# Altium project S7_CAS_lepo3002.PrjPcb (part 4 of 4)
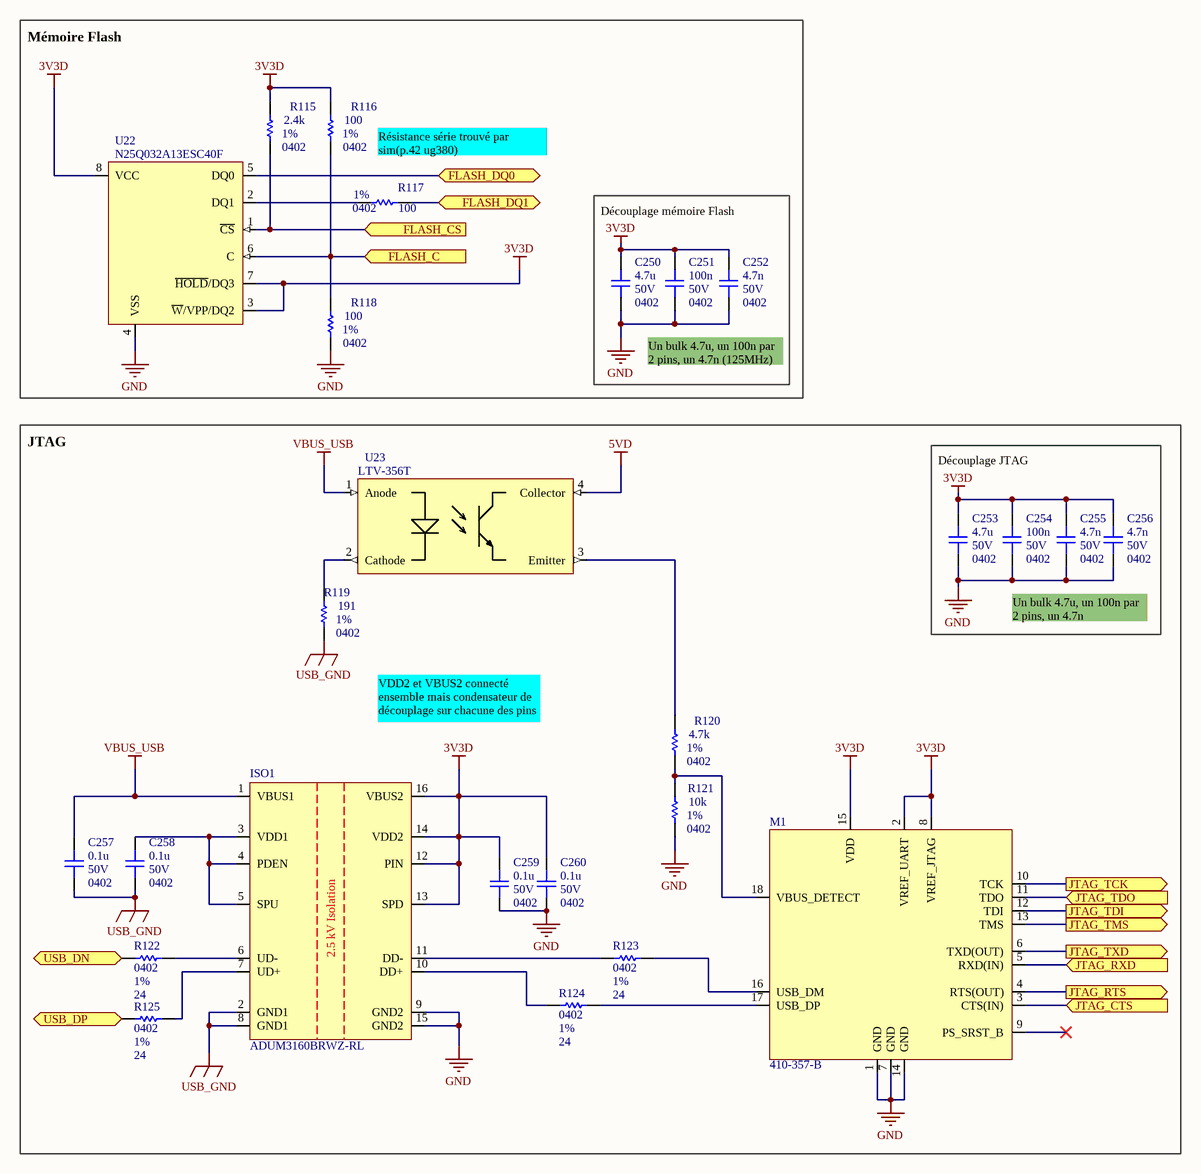
[diagram p15: PROB_S7CAS_FLASH-JTAG.SchDoc]

## Nets that join several sheets
1V2D: PROB_S7CAS_ArbreAlimentation (C30.1 C31.2 U6.4 U6.5), PROB_S7CAS_FPGA_2 (31 pins), PROB_S7CAS_PHY (C172.2 C173.2 U16.2)
1V5D: PROB_S7CAS_ArbreAlimentation (C27.2 R10.2 U1.9 U1.10), PROB_S7CAS_FPGA_2 (15 pins), PROB_S7CAS_FPGA_3 (20 pins), PROB_S7CAS_DDR (28 pins)
1V8D: PROB_S7CAS_ArbreAlimentation (8 pins), PROB_S7CAS_FPGA_1 (14 pins), PROB_S7CAS_DAC (15 pins), PROB_S7CAS_ADC (11 pins)
3V3A: PROB_S7CAS_ArbreAlimentation (C42.1 C43.2 U8.4 U8.5), PROB_S7CAS_INTERFACE (5 pins), PROB_S7CAS_PHY (L5.1), PROB_S7CAS_DAC (11 pins), PROB_S7CAS_ADC (9 pins)
3V3D: PROB_S7CAS_ArbreAlimentation (C20.1 C21.2 U4.4 U4.5), PROB_S7CAS_FPGA_1 (17 pins), PROB_S7CAS_FPGA_2 (47 pins), PROB_S7CAS_INTERFACE (U11.3 U12.3), PROB_S7CAS_Clock (26 pins), PROB_S7CAS_PHY (C174.2 C175.2 U16.17), PROB_S7CAS_MOTDRIVER (C240.2 R107.2 R110.2 U21.10), PROB_S7CAS_FLASH-JTAG (21 pins)
3V3DDR: PROB_S7CAS_ArbreAlimentation (C16.1 C17.2 U3.4 U3.5), PROB_S7CAS_DDR (C159.2 R57.2 U15.7 U15.10)
5VD: PROB_S7CAS_ArbreAlimentation (21 pins), PROB_S7CAS_FLASH-JTAG (U23.4)
5VN: PROB_S7CAS_ArbreAlimentation (C33.2 U9.5), PROB_S7CAS_DAC (C196.1 C197.1 C198.1 U18.4), PROB_S7CAS_ADC (12 pins)
5VP: PROB_S7CAS_ArbreAlimentation (12 pins), PROB_S7CAS_DAC (C186.2 C187.2 C188.2 U18.8), PROB_S7CAS_ADC (15 pins)
24V: PROB_S7CAS_Connectors (D2.2 D4.1 Q1.2), PROB_S7CAS_ArbreAlimentation (8 pins), PROB_S7CAS_INTERFACE (D18.A), PROB_S7CAS_MOTDRIVER (6 pins)
DDR_VREF: PROB_S7CAS_FPGA_2 (U10.AD7 U10.L6 U10.R6 U10.V6), PROB_S7CAS_DDR (6 pins)
GND: PROB_S7CAS_Title (MTH3.1 MTH4.1 MTH5.1), PROB_S7CAS_Connectors (35 pins), PROB_S7CAS_ArbreAlimentation (65 pins), PROB_S7CAS_FPGA_1 (10 pins), PROB_S7CAS_FPGA_2 (100 pins), PROB_S7CAS_FPGA_3 (8 pins), PROB_S7CAS_INTERFACE (11 pins), PROB_S7CAS_Clock (38 pins), PROB_S7CAS_DDR (72 pins), PROB_S7CAS_PHY (20 pins), PROB_S7CAS_DAC (35 pins), PROB_S7CAS_ADC (47 pins), PROB_S7CAS_MOTDRIVER (17 pins), PROB_S7CAS_FLASH-JTAG (17 pins)
USB_GND: PROB_S7CAS_Connectors (D5.4 J3.4 J3.5 J3.6), PROB_S7CAS_FLASH-JTAG (5 pins)
VBUS_USB: PROB_S7CAS_Connectors (L1.1), PROB_S7CAS_FLASH-JTAG (C257.2 ISO1.1 U23.1)
590BD_OE: PROB_S7CAS_FPGA_1 (U10.AA23), PROB_S7CAS_Clock (Y1.2)
AD91_CS: PROB_S7CAS_FPGA_1 (U10.V18), PROB_S7CAS_DAC (U17.33)
AD91_D0N: PROB_S7CAS_FPGA_2 (U10.Y13), PROB_S7CAS_DAC (U17.28)
AD91_D0P: PROB_S7CAS_FPGA_2 (U10.W13), PROB_S7CAS_DAC (U17.27)
AD91_D1N: PROB_S7CAS_FPGA_2 (U10.AB13), PROB_S7CAS_DAC (U17.26)
AD91_D1P: PROB_S7CAS_FPGA_2 (U10.AA13), PROB_S7CAS_DAC (U17.25)
AD91_D2N: PROB_S7CAS_FPGA_2 (U10.V14), PROB_S7CAS_DAC (U17.24)
AD91_D2P: PROB_S7CAS_FPGA_2 (U10.U15), PROB_S7CAS_DAC (U17.23)
AD91_D3N: PROB_S7CAS_FPGA_2 (U10.AB11), PROB_S7CAS_DAC (U17.22)
AD91_D3P: PROB_S7CAS_FPGA_2 (U10.AA11), PROB_S7CAS_DAC (U17.21)
AD91_D4N: PROB_S7CAS_FPGA_2 (U10.W14), PROB_S7CAS_DAC (U17.16)
AD91_D4P: PROB_S7CAS_FPGA_2 (U10.V13), PROB_S7CAS_DAC (U17.15)
AD91_D5N: PROB_S7CAS_FPGA_2 (U10.AD11), PROB_S7CAS_DAC (U17.14)
AD91_D5P: PROB_S7CAS_FPGA_2 (U10.AC11), PROB_S7CAS_DAC (U17.13)
AD91_D6N: PROB_S7CAS_FPGA_2 (U10.W12), PROB_S7CAS_DAC (U17.12)
AD91_D6P: PROB_S7CAS_FPGA_2 (U10.V12), PROB_S7CAS_DAC (U17.11)
AD91_D7N: PROB_S7CAS_FPGA_2 (U10.AF11), PROB_S7CAS_DAC (U17.10)
AD91_D7P: PROB_S7CAS_FPGA_2 (U10.AE11), PROB_S7CAS_DAC (U17.9)
AD91_DCIN: PROB_S7CAS_FPGA_2 (U10.U12), PROB_S7CAS_DAC (U17.18)
AD91_DCIP: PROB_S7CAS_FPGA_2 (U10.U13), PROB_S7CAS_DAC (U17.17)
AD91_FRAMEN: PROB_S7CAS_FPGA_2 (U10.AB10), PROB_S7CAS_DAC (U17.20)
AD91_FRAMEP: PROB_S7CAS_FPGA_2 (U10.Y10), PROB_S7CAS_DAC (U17.19)
AD91_IRQ: PROB_S7CAS_FPGA_1 (U10.V19), PROB_S7CAS_DAC (U17.34)
AD91_RESET: PROB_S7CAS_FPGA_1 (U10.U20), PROB_S7CAS_DAC (U17.36)
AD91_SCLK: PROB_S7CAS_FPGA_1 (U10.AC23), PROB_S7CAS_DAC (U17.32)
AD91_SDIO: PROB_S7CAS_FPGA_1 (U10.AC24), PROB_S7CAS_DAC (U17.31)
AD91_TXENABLE: PROB_S7CAS_FPGA_1 (U10.AE24), PROB_S7CAS_DAC (U17.30)
ADC_1: PROB_S7CAS_Connectors (D6.1 J4.1), PROB_S7CAS_ADC (R94.2 R96.2)
ADC_2: PROB_S7CAS_Connectors (D8.1 J6.1), PROB_S7CAS_ADC (R101.2 R104.2)
ADS62_CLKOUTM: PROB_S7CAS_FPGA_1 (U10.C14), PROB_S7CAS_ADC (U19.56)
ADS62_CLKOUTP: PROB_S7CAS_FPGA_1 (U10.D14), PROB_S7CAS_ADC (U19.57)
ADS62_CTRL1: PROB_S7CAS_FPGA_1 (U10.R19), PROB_S7CAS_ADC (U19.35)
ADS62_CTRL2: PROB_S7CAS_FPGA_1 (U10.R17), PROB_S7CAS_ADC (U19.36)
ADS62_CTRL3: PROB_S7CAS_FPGA_1 (U10.R18), PROB_S7CAS_ADC (U19.37)
ADS62_DA0N: PROB_S7CAS_FPGA_1 (U10.G14), PROB_S7CAS_ADC (U19.40)
ADS62_DA0P: PROB_S7CAS_FPGA_1 (U10.J14), PROB_S7CAS_ADC (U19.41)
ADS62_DA2N: PROB_S7CAS_FPGA_1 (U10.D15), PROB_S7CAS_ADC (U19.42)
ADS62_DA2P: PROB_S7CAS_FPGA_1 (U10.E14), PROB_S7CAS_ADC (U19.43)
ADS62_DA4N: PROB_S7CAS_FPGA_1 (U10.C16), PROB_S7CAS_ADC (U19.44)
ADS62_DA4P: PROB_S7CAS_FPGA_1 (U10.D16), PROB_S7CAS_ADC (U19.45)
ADS62_DA6N: PROB_S7CAS_FPGA_1 (U10.F15), PROB_S7CAS_ADC (U19.46)
ADS62_DA6P: PROB_S7CAS_FPGA_1 (U10.G16), PROB_S7CAS_ADC (U19.47)
ADS62_DA8N: PROB_S7CAS_FPGA_1 (U10.E17), PROB_S7CAS_ADC (U19.50)
ADS62_DA8P: PROB_S7CAS_FPGA_1 (U10.F17), PROB_S7CAS_ADC (U19.51)
ADS62_DA10N: PROB_S7CAS_FPGA_1 (U10.E16), PROB_S7CAS_ADC (U19.52)
ADS62_DA10P: PROB_S7CAS_FPGA_1 (U10.F16), PROB_S7CAS_ADC (U19.53)
ADS62_DA12N: PROB_S7CAS_FPGA_1 (U10.A17), PROB_S7CAS_ADC (U19.54)
ADS62_DA12P: PROB_S7CAS_FPGA_1 (U10.C17), PROB_S7CAS_ADC (U19.55)
ADS62_DB0N: PROB_S7CAS_FPGA_1 (U10.H15), PROB_S7CAS_ADC (U19.60)
ADS62_DB0P: PROB_S7CAS_FPGA_1 (U10.J15), PROB_S7CAS_ADC (U19.61)
ADS62_DB2N: PROB_S7CAS_FPGA_1 (U10.C18), PROB_S7CAS_ADC (U19.62)
ADS62_DB2P: PROB_S7CAS_FPGA_1 (U10.D18), PROB_S7CAS_ADC (U19.63)
ADS62_DB4N: PROB_S7CAS_FPGA_1 (U10.D19), PROB_S7CAS_ADC (U19.2)
ADS62_DB4P: PROB_S7CAS_FPGA_1 (U10.E19), PROB_S7CAS_ADC (U19.3)
ADS62_DB6N: PROB_S7CAS_FPGA_1 (U10.G17), PROB_S7CAS_ADC (U19.4)
ADS62_DB6P: PROB_S7CAS_FPGA_1 (U10.H16), PROB_S7CAS_ADC (U19.5)
ADS62_DB8N: PROB_S7CAS_FPGA_1 (U10.C20), PROB_S7CAS_ADC (U19.6)
ADS62_DB8P: PROB_S7CAS_FPGA_1 (U10.D21), PROB_S7CAS_ADC (U19.7)
ADS62_DB10N: PROB_S7CAS_FPGA_1 (U10.E18), PROB_S7CAS_ADC (U19.8)
ADS62_DB10P: PROB_S7CAS_FPGA_1 (U10.F18), PROB_S7CAS_ADC (U19.9)
ADS62_DB12N: PROB_S7CAS_FPGA_1 (U10.D20), PROB_S7CAS_ADC (U19.10)
ADS62_DB12P: PROB_S7CAS_FPGA_1 (U10.E20), PROB_S7CAS_ADC (U19.11)
ADS62_RESET: PROB_S7CAS_FPGA_1 (U10.R21), PROB_S7CAS_ADC (U19.12)
ADS62_SCLK: PROB_S7CAS_FPGA_1 (U10.P17), PROB_S7CAS_ADC (U19.13)
ADS62_SDATA: PROB_S7CAS_FPGA_1 (U10.R20), PROB_S7CAS_ADC (U19.14)
ADS62_SDOUT: PROB_S7CAS_FPGA_1 (U10.R22), PROB_S7CAS_ADC (U19.64)
ADS62_SEN: PROB_S7CAS_FPGA_1 (U10.P18), PROB_S7CAS_ADC (U19.15)
CDCE_CLKN_100MHz: PROB_S7CAS_FPGA_1 (U10.A15), PROB_S7CAS_Clock (U13.17)
CDCE_CLKN_200MHz: PROB_S7CAS_Clock (U13.20), PROB_S7CAS_ADC (C206.1 R93.1)
CDCE_CLKN_400MHz: PROB_S7CAS_Clock (U13.28), PROB_S7CAS_DAC (C180.1 R85.1)
CDCE_CLKP_100MHz: PROB_S7CAS_FPGA_1 (U10.C15), PROB_S7CAS_Clock (U13.16)
CDCE_CLKP_200MHz: PROB_S7CAS_Clock (U13.19), PROB_S7CAS_ADC (C205.1 R93.2)
CDCE_CLKP_400MHz: PROB_S7CAS_Clock (U13.27), PROB_S7CAS_DAC (C179.1 R85.2)
CDCE_PLL_LOCK: PROB_S7CAS_FPGA_1 (U10.V17), PROB_S7CAS_Clock (U13.37)
CDCE_PWRDN: PROB_S7CAS_FPGA_1 (U10.T22), PROB_S7CAS_Clock (U13.12)
CDCE_REF_SEL: PROB_S7CAS_FPGA_1 (U10.U22), PROB_S7CAS_Clock (U13.31)
CDCE_SPI_CLK: PROB_S7CAS_FPGA_1 (U10.T18), PROB_S7CAS_Clock (U13.24)
CDCE_SPI_LE: PROB_S7CAS_FPGA_1 (U10.U23), PROB_S7CAS_Clock (U13.25)
CDCE_SPI_MISO: PROB_S7CAS_FPGA_1 (U10.U21), PROB_S7CAS_Clock (U13.22)
CDCE_SPI_MOSI: PROB_S7CAS_FPGA_1 (U10.T19), PROB_S7CAS_Clock (U13.23)
CDCE_SYNC: PROB_S7CAS_FPGA_1 (U10.U17), PROB_S7CAS_Clock (U13.14)
DAC_1: PROB_S7CAS_Connectors (D11.1 J7.1), PROB_S7CAS_DAC (R78.2)
DAC_2: PROB_S7CAS_Connectors (D13.1 J8.1), PROB_S7CAS_DAC (R87.2)
DDR3_A0: PROB_S7CAS_FPGA_2 (U10.N7), PROB_S7CAS_DDR (R34.1 U14.N3)
DDR3_A1: PROB_S7CAS_FPGA_2 (U10.N6), PROB_S7CAS_DDR (R35.1 U14.P7)
DDR3_A2: PROB_S7CAS_FPGA_2 (U10.R9), PROB_S7CAS_DDR (R36.1 U14.P3)
DDR3_A3: PROB_S7CAS_FPGA_2 (U10.P7), PROB_S7CAS_DDR (R37.1 U14.N2)
DDR3_A4: PROB_S7CAS_FPGA_2 (U10.N9), PROB_S7CAS_DDR (R38.1 U14.P8)
DDR3_A5: PROB_S7CAS_FPGA_2 (U10.R2), PROB_S7CAS_DDR (R39.1 U14.P2)
DDR3_A6: PROB_S7CAS_FPGA_2 (U10.R1), PROB_S7CAS_DDR (R40.1 U14.R8)
DDR3_A7: PROB_S7CAS_FPGA_2 (U10.P10), PROB_S7CAS_DDR (R41.1 U14.R2)
DDR3_A8: PROB_S7CAS_FPGA_2 (U10.N4), PROB_S7CAS_DDR (R42.1 U14.T8)
DDR3_A9: PROB_S7CAS_FPGA_2 (U10.N3), PROB_S7CAS_DDR (R43.1 U14.R3)
DDR3_A10: PROB_S7CAS_FPGA_2 (U10.M10), PROB_S7CAS_DDR (R44.1 U14.L7)
DDR3_A11: PROB_S7CAS_FPGA_2 (U10.L3), PROB_S7CAS_DDR (R45.1 U14.R7)
DDR3_A12: PROB_S7CAS_FPGA_2 (U10.M8), PROB_S7CAS_DDR (R46.1 U14.N7)
DDR3_A13: PROB_S7CAS_FPGA_2 (U10.M6), PROB_S7CAS_DDR (R47.1 U14.T3)
DDR3_BA0: PROB_S7CAS_FPGA_2 (U10.P3), PROB_S7CAS_DDR (R49.1 U14.M2)
DDR3_BA1: PROB_S7CAS_FPGA_2 (U10.P1), PROB_S7CAS_DDR (R50.1 U14.N8)
DDR3_BA2: PROB_S7CAS_FPGA_2 (U10.N5), PROB_S7CAS_DDR (R51.1 U14.M3)
DDR3_CAS: PROB_S7CAS_FPGA_2 (U10.P8), PROB_S7CAS_DDR (R55.1 U14.K3)
DDR3_CKE: PROB_S7CAS_FPGA_2 (U10.M9), PROB_S7CAS_DDR (R52.1 U14.K9)
DDR3_CKN: PROB_S7CAS_FPGA_2 (U10.R3), PROB_S7CAS_DDR (U14.K7)
DDR3_CKP: PROB_S7CAS_FPGA_2 (U10.R4), PROB_S7CAS_DDR (U14.J7)
DDR3_CS: PROB_S7CAS_FPGA_2 (U10.L7), PROB_S7CAS_DDR (R53.1 U14.L2)
DDR3_DQ0: PROB_S7CAS_FPGA_2 (U10.Y3), PROB_S7CAS_DDR (U14.E3)
DDR3_DQ1: PROB_S7CAS_FPGA_2 (U10.Y1), PROB_S7CAS_DDR (U14.F7)
DDR3_DQ2: PROB_S7CAS_FPGA_2 (U10.W2), PROB_S7CAS_DDR (U14.F2)
DDR3_DQ3: PROB_S7CAS_FPGA_2 (U10.W1), PROB_S7CAS_DDR (U14.F8)
DDR3_DQ4: PROB_S7CAS_FPGA_2 (U10.T3), PROB_S7CAS_DDR (U14.H3)
DDR3_DQ5: PROB_S7CAS_FPGA_2 (U10.T1), PROB_S7CAS_DDR (U14.H8)
DDR3_DQ6: PROB_S7CAS_FPGA_2 (U10.U2), PROB_S7CAS_DDR (U14.G2)
DDR3_DQ7: PROB_S7CAS_FPGA_2 (U10.U1), PROB_S7CAS_DDR (U14.H7)
DDR3_DQ8: PROB_S7CAS_FPGA_2 (U10.AA2), PROB_S7CAS_DDR (U14.D7)
DDR3_DQ9: PROB_S7CAS_FPGA_2 (U10.AA1), PROB_S7CAS_DDR (U14.C3)
DDR3_DQ10: PROB_S7CAS_FPGA_2 (U10.AE2), PROB_S7CAS_DDR (U14.C8)
DDR3_DQ11: PROB_S7CAS_FPGA_2 (U10.AE1), PROB_S7CAS_DDR (U14.C2)
DDR3_DQ12: PROB_S7CAS_FPGA_2 (U10.AD3), PROB_S7CAS_DDR (U14.A7)
DDR3_DQ13: PROB_S7CAS_FPGA_2 (U10.AD1), PROB_S7CAS_DDR (U14.A2)
DDR3_DQ14: PROB_S7CAS_FPGA_2 (U10.AB3), PROB_S7CAS_DDR (U14.B8)
DDR3_DQ15: PROB_S7CAS_FPGA_2 (U10.AB1), PROB_S7CAS_DDR (U14.A3)
DDR3_LDM: PROB_S7CAS_FPGA_2 (U10.W3), PROB_S7CAS_DDR (U14.E7)
DDR3_LDQS_N: PROB_S7CAS_FPGA_2 (U10.V1), PROB_S7CAS_DDR (U14.G3)
DDR3_LDQS_P: PROB_S7CAS_FPGA_2 (U10.V3), PROB_S7CAS_DDR (U14.F3)
DDR3_ODT: PROB_S7CAS_FPGA_2 (U10.P6), PROB_S7CAS_DDR (R48.1 U14.K1)
DDR3_RAS: PROB_S7CAS_FPGA_2 (U10.N8), PROB_S7CAS_DDR (R54.1 U14.J3)
DDR3_RESET: PROB_S7CAS_FPGA_2 (U10.L4), PROB_S7CAS_DDR (U14.T2)
DDR3_UDM: PROB_S7CAS_FPGA_2 (U10.V4), PROB_S7CAS_DDR (U14.D3)
DDR3_UDQS_N: PROB_S7CAS_FPGA_2 (U10.AC1), PROB_S7CAS_DDR (U14.B7)
DDR3_UDQS_P: PROB_S7CAS_FPGA_2 (U10.AC2), PROB_S7CAS_DDR (U14.C7)
DDR3_WE: PROB_S7CAS_FPGA_2 (U10.P5), PROB_S7CAS_DDR (R56.1 U14.L3)
DN: PROB_S7CAS_Connectors (D5.3 J3.2), PROB_S7CAS_FLASH-JTAG (R122.2)
DP: PROB_S7CAS_Connectors (D5.5 J3.3), PROB_S7CAS_FLASH-JTAG (R125.2)
DRV8811_AOUT1: PROB_S7CAS_Connectors (D7.1 J5.1), PROB_S7CAS_MOTDRIVER (U21.4)
DRV8811_AOUT2: PROB_S7CAS_Connectors (D12.1 J5.4), PROB_S7CAS_MOTDRIVER (U21.25)
DRV8811_BOUT1: PROB_S7CAS_Connectors (D9.1 J5.2), PROB_S7CAS_MOTDRIVER (U21.11)
DRV8811_BOUT2: PROB_S7CAS_Connectors (D10.1 J5.3), PROB_S7CAS_MOTDRIVER (U21.18)
DRV8811_DIR: PROB_S7CAS_FPGA_1 (U10.E8), PROB_S7CAS_MOTDRIVER (U21.3)
DRV8811_EN: PROB_S7CAS_FPGA_1 (U10.A7), PROB_S7CAS_MOTDRIVER (U21.26)
DRV8811_HOME: PROB_S7CAS_FPGA_1 (U10.F9), PROB_S7CAS_MOTDRIVER (U21.2)
DRV8811_RESET: PROB_S7CAS_FPGA_1 (U10.C7), PROB_S7CAS_MOTDRIVER (U21.17)
DRV8811_SLEEP: PROB_S7CAS_FPGA_1 (U10.D6), PROB_S7CAS_MOTDRIVER (U21.27)
DRV8811_SR: PROB_S7CAS_FPGA_1 (U10.C8), PROB_S7CAS_MOTDRIVER (U21.16)
DRV8811_STEP: PROB_S7CAS_FPGA_1 (U10.A5), PROB_S7CAS_MOTDRIVER (U21.19)
DRV8811_USM0: PROB_S7CAS_FPGA_1 (U10.D7), PROB_S7CAS_MOTDRIVER (U21.13)
DRV8811_USM1: PROB_S7CAS_FPGA_1 (U10.D8), PROB_S7CAS_MOTDRIVER (U21.12)
FLASH_C: PROB_S7CAS_FPGA_2 (U10.AD22), PROB_S7CAS_FLASH-JTAG (R116.1 R118.2 U22.6)
FLASH_CS: PROB_S7CAS_FPGA_2 (U10.AF4), PROB_S7CAS_FLASH-JTAG (R115.1 U22.1)
FLASH_DQ0: PROB_S7CAS_FPGA_2 (U10.AF20), PROB_S7CAS_FLASH-JTAG (U22.5)
FLASH_DQ1: PROB_S7CAS_FPGA_2 (U10.AD20), PROB_S7CAS_FLASH-JTAG (R117.2)
FPGA_BTN0: PROB_S7CAS_FPGA_1 (U10.T20), PROB_S7CAS_INTERFACE (R29.2 SW2.2 SW2.3)
FPGA_BTN1: PROB_S7CAS_FPGA_1 (U10.AA24), PROB_S7CAS_INTERFACE (R30.2 SW3.2 SW3.3)
FPGA_LED0: PROB_S7CAS_FPGA_1 (U10.A4), PROB_S7CAS_INTERFACE (D14.A)
FPGA_LED1: PROB_S7CAS_FPGA_1 (U10.E6), PROB_S7CAS_INTERFACE (D15.A)
FPGA_LED2: PROB_S7CAS_FPGA_1 (U10.D5), PROB_S7CAS_INTERFACE (D16.A)
FPGA_LED3: PROB_S7CAS_FPGA_1 (U10.C5), PROB_S7CAS_INTERFACE (D17.A)
FPGA_RESET: PROB_S7CAS_FPGA_2 (U10.AF3), PROB_S7CAS_INTERFACE (R23.1 SW1.1 SW1.4)
JTAG_CTS: PROB_S7CAS_FPGA_1 (U10.A6), PROB_S7CAS_FLASH-JTAG (M1.3)
JTAG_RTS: PROB_S7CAS_FPGA_1 (U10.B6), PROB_S7CAS_FLASH-JTAG (M1.4)
JTAG_RXD: PROB_S7CAS_FPGA_1 (U10.F7), PROB_S7CAS_FLASH-JTAG (M1.5)
JTAG_TCK: PROB_S7CAS_FPGA_2 (U10.E21), PROB_S7CAS_FLASH-JTAG (M1.10)
JTAG_TDI: PROB_S7CAS_FPGA_2 (U10.F20), PROB_S7CAS_FLASH-JTAG (M1.12)
JTAG_TDO: PROB_S7CAS_FPGA_2 (U10.A24), PROB_S7CAS_FLASH-JTAG (M1.11)
JTAG_TMS: PROB_S7CAS_FPGA_2 (U10.C23), PROB_S7CAS_FLASH-JTAG (M1.13)
JTAG_TXD: PROB_S7CAS_FPGA_1 (U10.G8), PROB_S7CAS_FLASH-JTAG (M1.6)
KSZ_RXM: PROB_S7CAS_Connectors (R2.2 T1.8), PROB_S7CAS_PHY (U16.4)
KSZ_RXP: PROB_S7CAS_Connectors (R3.2 T1.6), PROB_S7CAS_PHY (U16.5)
KSZ_TXM: PROB_S7CAS_Connectors (R4.2 T1.3), PROB_S7CAS_PHY (U16.6)
KSZ_TXP: PROB_S7CAS_Connectors (R5.2 T1.1), PROB_S7CAS_PHY (U16.7)
PHY_COL: PROB_S7CAS_FPGA_1 (U10.F13), PROB_S7CAS_PHY (R61.2)
PHY_CRS: PROB_S7CAS_FPGA_1 (U10.D13), PROB_S7CAS_PHY (R62.2)
PHY_INT: PROB_S7CAS_FPGA_1 (U10.F10), PROB_S7CAS_PHY (R64.2)
PHY_LED0: PROB_S7CAS_Connectors (J2.10), PROB_S7CAS_PHY (U16.30)
PHY_MDC: PROB_S7CAS_FPGA_1 (U10.A9), PROB_S7CAS_PHY (U16.12)
PHY_MDIO: PROB_S7CAS_FPGA_1 (U10.E10), PROB_S7CAS_PHY (R65.1 U16.11)
PHY_RXC: PROB_S7CAS_FPGA_1 (U10.C13), PROB_S7CAS_PHY (R72.2)
PHY_RXD0: PROB_S7CAS_FPGA_1 (U10.D11), PROB_S7CAS_PHY (R68.2)
PHY_RXD1: PROB_S7CAS_FPGA_1 (U10.A10), PROB_S7CAS_PHY (R69.2)
PHY_RXD2: PROB_S7CAS_FPGA_1 (U10.B10), PROB_S7CAS_PHY (R70.2)
PHY_RXD3: PROB_S7CAS_FPGA_1 (U10.C10), PROB_S7CAS_PHY (R71.2)
PHY_RXDV: PROB_S7CAS_FPGA_1 (U10.D10), PROB_S7CAS_PHY (R66.2)
PHY_RXER: PROB_S7CAS_FPGA_1 (U10.F11), PROB_S7CAS_PHY (R67.2)
PHY_TXC: PROB_S7CAS_FPGA_1 (U10.A13), PROB_S7CAS_PHY (R73.2)
PHY_TXD0: PROB_S7CAS_FPGA_1 (U10.D12), PROB_S7CAS_PHY (U16.24)
PHY_TXD1: PROB_S7CAS_FPGA_1 (U10.A12), PROB_S7CAS_PHY (U16.25)
PHY_TXD2: PROB_S7CAS_FPGA_1 (U10.B12), PROB_S7CAS_PHY (U16.26)
PHY_TXD3: PROB_S7CAS_FPGA_1 (U10.A11), PROB_S7CAS_PHY (U16.27)
PHY_TXEN: PROB_S7CAS_FPGA_1 (U10.C11), PROB_S7CAS_PHY (U16.23)
PHY_TXER: PROB_S7CAS_FPGA_1 (U10.C12), PROB_S7CAS_PHY (U16.31)
TC74_CLK0: PROB_S7CAS_FPGA_1 (U10.A8), PROB_S7CAS_INTERFACE (U11.4)
TC74_CLK1: PROB_S7CAS_FPGA_1 (U10.E9), PROB_S7CAS_INTERFACE (U12.4)
TC74_SDA0: PROB_S7CAS_FPGA_1 (U10.C9), PROB_S7CAS_INTERFACE (U11.5)
TC74_SDA1: PROB_S7CAS_FPGA_1 (U10.B8), PROB_S7CAS_INTERFACE (U12.5)